# EAGLE design BikeLight POC (EAGLE 8.5.0)
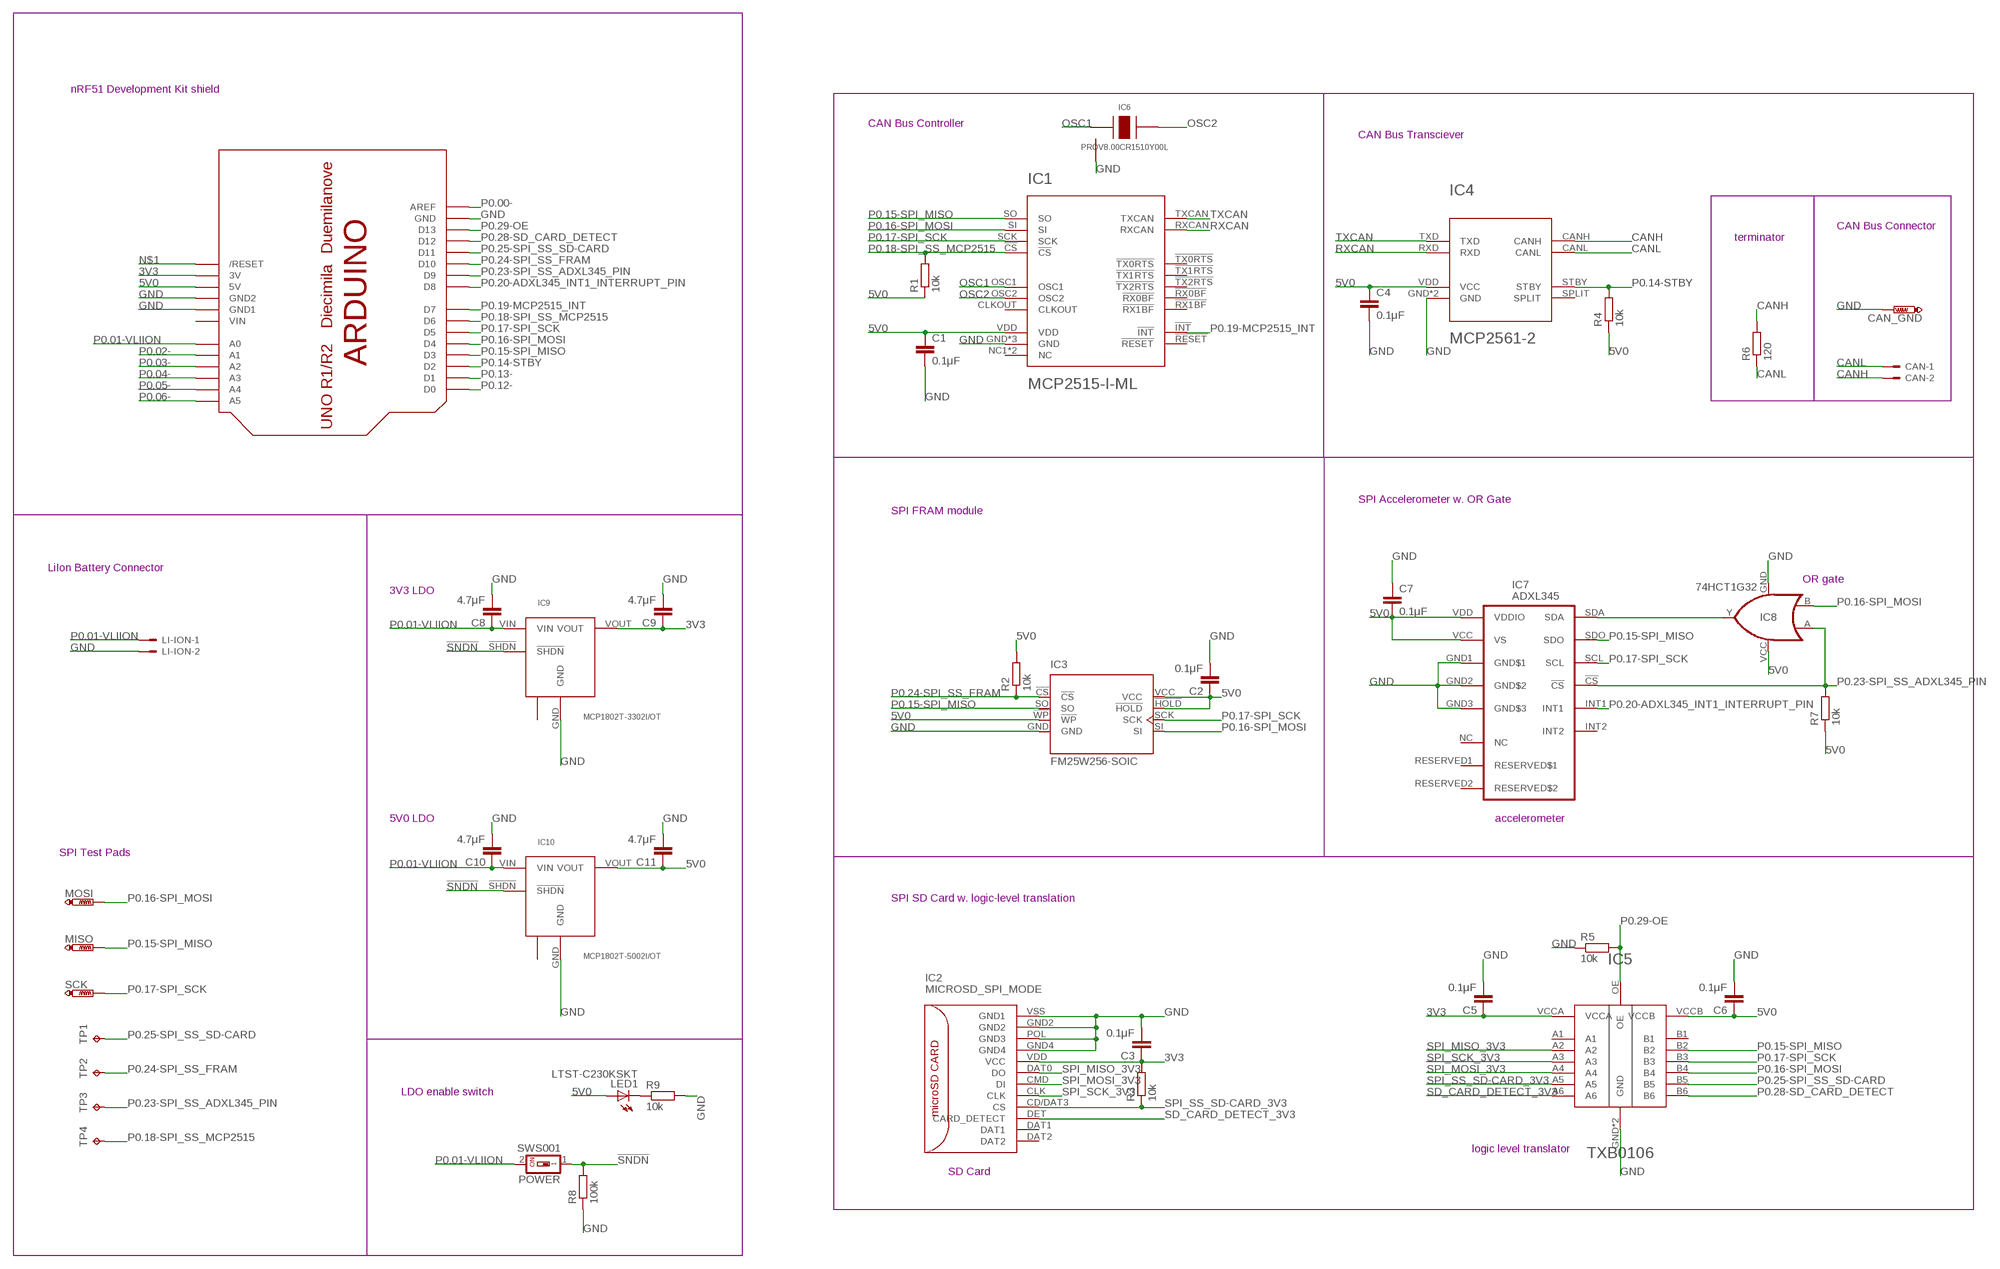
[diagram p0: schematic, sheet 1]

## Parts
BRD1  BikeLight POC  ARDUINOUNO  [ARDUINO]
C1  0.1μF  C-EUC0805  [C0805]
C2  0.1μF  C-EUC0805  [C0805]
C3  0.1μF  C-EUC0805  [C0805]
C4  0.1μF  C-EUC0805  [C0805]
C5  0.1μF  C-EUC0805  [C0805]
C6  0.1μF  C-EUC0805  [C0805]
C7  0.1μF  C-EUC0805  [C0805]
C8  4.7μF  C-EUC0805  [C0805]
C9  4.7μF  C-EUC0805  [C0805]
C10  4.7μF  C-EUC0805  [C0805]
C11  4.7μF  C-EUC0805  [C0805]
CAN  22-23-2021  [22-23-2021]
CAN_GND  PTR1PAD1-13Y  [P1-13Y]
IC1  MCP2515-I-ML  [QFN20]
IC2  MICROSD_SPI_MODE  [MICRO_SD_CONNECTOR]
IC3  FM25W256-SOIC  [SOIC08]
IC4  MCP2561-2  [DFN10]
IC5  TXB0106  [VQFN16]
IC6  PRQV8.00CR1510Y00L  PRQV  [SMT]
IC7  ADXL345  [LGA14]
IC8  74HCT1G32  74HCT1G32GW-DC  [SOT353/5]
IC9  MCP1802T-3302I/OT  MCP1802  [SOT23-5]
IC10  MCP1802T-5002I/OT  MCP1802  [SOT23-5]
LED1  LTST-C230KSKT  LEDCHIPLED_1206  [CHIPLED_1206]
LI-ION  22-23-2021  [22-23-2021]
MISO  PTR1PAD1-13Y  [P1-13Y]
MOSI  PTR1PAD1-13Y  [P1-13Y]
POWER  SWS001  [SMS-001]
R1  10k  R-EU_R0805  [R0805]
R2  10k  R-EU_R0805  [R0805]
R3  10k  R-EU_R0805  [R0805]
R4  10k  R-EU_R0805  [R0805]
R5  10k  R-EU_R0805  [R0805]
R6  120  R-EU_R0805  [R0805]
R7  10k  R-EU_R0805  [R0805]
R8  100k  R-EU_R0805  [R0805]
R9  10k  R-EU_R0805  [R0805]
SCK  PTR1PAD1-13Y  [P1-13Y]
TP1  TPPAD1-13  [P1-13]
TP2  TPPAD1-13  [P1-13]
TP3  TPPAD1-13  [P1-13]
TP4  TPPAD1-13  [P1-13]

## Nets
3V3: BRD1.3V C3.1 C5.1 C9.1 IC2.VDD(VCC) IC5.VCCA IC9.VOUT R3.2
5V0: BRD1.5V C1.1 C2.1 C4.1 C6.1 C7.2 C11.1 IC1.VDD IC3.!HOLD! IC3.!WP! IC3.VCC IC4.VDD(VCC) IC5.VCCB IC7.VCC(VS) IC7.VDD(VDDIO) IC8.VCC IC10.VOUT LED1.A R1.1 R2.2 R4.1 R7.1
!SNDN!: IC9.!SHDN! IC10.!SHDN! POWER.1 R8.2
CANH: CAN.2 IC4.CANH R6.2
CANL: CAN.1 IC4.CANL R6.1
GND: BRD1.GND BRD1.GND1 BRD1.GND2 C1.2 C2.2 C3.2 C4.2 C5.2 C6.2 C7.1 C8.2 C9.2 C10.2 C11.2 CAN_GND.TP IC1.GND IC1.GND1(GND) IC1.GND6(GND) IC2.GND2 IC2.GND4 IC2.POL(GND3) IC2.VSS(GND1) IC3.GND IC4.GND IC4.VSS(GND) IC5.GND IC5.GND1(GND) IC6.GND IC7.GND1(GND$1) IC7.GND2(GND$2) IC7.GND3(GND$3) IC8.GND IC9.GND IC10.GND LI-ION.2 R5.1 R8.1 R9.2
N$1: BRD1.RESET(/RESET)
N$2: LED1.C R9.1
OSC1: IC1.OSC1 IC6.XTAL1
OSC2: IC1.OSC2 IC6.XTAL2
P0.00-: BRD1.AREF
P0.01-VLIION: BRD1.A0 C8.1 C10.1 IC9.VIN IC10.VIN LI-ION.1 POWER.2
P0.02-: BRD1.A1
P0.03-: BRD1.A2
P0.04-: BRD1.A3
P0.05-: BRD1.A4
P0.06-: BRD1.A5
P0.12-: BRD1.D0
P0.13-: BRD1.D1
P0.14-STBY: BRD1.D2 IC4.STBY R4.2
P0.15-SPI_MISO: BRD1.D3 IC1.SO IC3.SO IC5.B2 IC7.SDO MISO.TP
P0.16-SPI_MOSI: BRD1.D4 IC1.SI IC3.SI IC5.B4 IC8.B MOSI.TP
P0.17-SPI_SCK: BRD1.D5 IC1.SCK IC3.SCK IC5.B3 IC7.SCL SCK.TP
P0.18-SPI_SS_MCP2515: BRD1.D6 IC1.!CS! R1.2 TP4.TP
P0.19-MCP2515_INT: BRD1.D7 IC1.!INT!
P0.20-ADXL345_INT1_INTERRUPT_PIN: BRD1.D8 IC7.INT1
P0.23-SPI_SS_ADXL345_PIN: BRD1.D9 IC7.!CS! IC8.A R7.2 TP3.TP
P0.24-SPI_SS_FRAM: BRD1.D10 IC3.!CS! R2.1 TP2.TP
P0.25-SPI_SS_SD-CARD: BRD1.D11 IC5.B5 TP1.TP
P0.28-SD_CARD_DETECT: BRD1.D12 IC5.B6
P0.29-OE: BRD1.D13 IC5.OE R5.2
RXCAN: IC1.RXCAN IC4.RXD
SD_CARD_DETECT_3V3: IC2.DET(CARD_DETECT) IC5.A6
SDA: IC7.SDA IC8.Y
SPI_MISO_3V3: IC2.DAT0(DO) IC5.A2
SPI_MOSI_3V3: IC2.CMD(DI) IC5.A4
SPI_SCK_3V3: IC2.CLK IC5.A3
SPI_SS_SD-CARD_3V3: IC2.CD/DAT3(CS) IC5.A5 R3.1
TXCAN: IC1.TXCAN IC4.TXD
Unconnected: IC1.!RESET! IC1.!RX0BF! IC1.!RX1BF! IC1.!TX0RTS! IC1.!TX1RTS! IC1.!TX2RTS! IC1.CLKOUT IC1.NC1(NC) IC1.NC2(NC) IC2.DAT1 IC2.DAT2 IC4.SPLIT IC5.A1 IC5.B1 IC7.INT2 IC7.NC IC7.RESERVED1(RESERVED$1) IC7.RESERVED2(RESERVED$2) IC9.NC IC10.NC

## Notes on the sheet
- nRF51 Development Kit shield
- CAN Bus Controller
- CAN Bus Transciever
- CAN Bus Connector
- terminator
- SPI Accelerometer w. OR Gate
- SPI FRAM module
- LiIon Battery Connector
- OR gate
- 3V3 LDO
- 5V0 LDO | accelerometer
- SPI Test Pads
- SPI SD Card w. logic-level translation
- LDO enable switch
- logic level translator
- SD Card

## Power pins joined to a net without a drawn wire
VIN: BRD1.VIN

## Library data of the parts
BRD1 = adafruit:ARDUINO: Arduino Diecimila/Duemilanove Make a shield with ease, this package has all the named pins as well as the two mounting drill holes and an outline of the USB and DC power connector. The outline is on the DIMENSION layer, so if your board house uses it they will cut the outline to match. http://www.ladyada.net/library/pcb/eaglelibrary.html
C1-C11 = rcl:C-EU: CAPACITOR, European symbol
CAN LI-ION = con-molex:22-23-2021: .100" (2.54mm) Center Header - 2 Pin; MF: MOLEX; MPN: 22-23-2021; OC_FARNELL: 1462926; OC_NEWARK: 25C3832
CAN_GND MISO MOSI SCK = testpad:PTR1: TEST PIN
IC1 = MCP2515-I-ML - Standalonce CAN Controller with SPI Interface:MCP2515-I-ML
IC2 = Molex SD-47309 SD Card Slot:MICROSD_SPI_MODE: MOLEX - 49225-0821 - CONNECTEUR MICRO SD PUSH/PUSH REV Fabricant: MOLEX Code commande Farnell: 1366700 <http://fr.farnell.com/molex/49225-0821/connecteur-micro-sd-push-push-rev/dp/1366700?Ntt=1366700> Référence fabricant: 49225-0821
IC3 = FM25W256 FERAM:FM25W256: FeRAM Module; OC_FARNELL: unknown; OC_NEWARK: unknown
IC4 = MCP2561-2 - High-Speed CAN Transceiver:MCP2561-2
IC5 = TXB0106 - Logic Level Translator:TXB0106
IC6 = PRQV8.00CR1510Y00L - 8MHz resonator:PRQV
IC7 = ADXL345 Accelerometer:ADXL345: 3-Axis, ±2 g/±4 g/±8 g/±16 g Digital Accelerometer
IC8 = 74HCT1G32GW - OR Gate:74HCT1G32GW: Two Input OR gate
IC9 IC10 = MCP1802 LDO:MCP1802
LED1 = led:LED: LED OSRAM: - CHIPLED LG R971, LG N971, LY N971, LG Q971, LY Q971, LO R971, LY R971 LH N974, LH R974 LS Q976, LO Q976, LY Q976 LO Q996 - Hyper CHIPLED LW Q18S LB Q993, LB Q99A, LB R99A - SideLED LS A670, LO A670, LY A670, LG A670, LP A670 LB A673, LV A673, LT A673, LW A673 LH A674 LY A675 LS A676, LA A676, LO A676, LY A676, LW A676 LS A679, LY A679, LG A679 - Hyper Micro SIDELED® LS Y876, LA Y876, LO Y876, LY Y876 LT Y87S - SmartLED LW L88C, LW L88S LB L89C, LB L89S, LG L890 LS L89K, LO L89K, LY L89K LS L896, LA L896, LO L896, LY L896 - TOPLED LS T670, LO T670, LY T670, LG T670, LP T670 LSG T670, LSP T670, LSY T670, LOP T670, LYG T670 LG T671, LOG T671, LSG T671 LB T673, LV T673, LT T673, LW T673 LH T674 LS T676, LA T676, LO T676, LY T676, LB T676, LH T676, LSB T676, LW T676 LB T67C, LV T67C, LT T67C, LS T67K, LO T67K, LY T67K, LW E67C LS E67B, LA E67B, LO E67B, LY E67B, LB E67C, LV E67C, LT E67C LW T67C LS T679, LY T679, LG T679 LS T770, LO T770, LY T770, LG T770, LP T770 LB T773, LV T773, LT T773, LW T773 LH T774 LS E675, LA E675, LY E675, LS T675 LS T776, LA T776, LO T776, LY T776, LB T776 LHGB T686 LT T68C, LB T68C - Hyper Mini TOPLED® LB M676 - Mini TOPLED Santana® LG M470 LS M47K, LO M47K, LY M47K Source: http://www.osram.convergy.de LUXEON: - LUMILED® LXK2-PW12-R00, LXK2-PW12-S00, LXK2-PW14-U00, LXK2-PW14-V00 LXK2-PM12-R00, LXK2-PM12-S00, LXK2-PM14-U00 LXK2-PE12-Q00, LXK2-PE12-R00, LXK2-PE12-S00, LXK2-PE14-T00, LXK2-PE14-U00 LXK2-PB12-K00, LXK2-PB12-L00, LXK2-PB12-M00, LXK2-PB14-N00, LXK2-PB14-P00, LXK2-PB14-Q00 LXK2-PR12-L00, LXK2-PR12-M00, LXK2-PR14-Q00, LXK2-PR14-R00 LXK2-PD12-Q00, LXK2-PD12-R00, LXK2-PD12-S00 LXK2-PH12-R00, LXK2-PH12-S00 LXK2-PL12-P00, LXK2-PL12-Q00, LXK2-PL12-R00 Source: www.luxeon.com KINGBRIGHT: KA-3528ASYC Source: www.kingbright.com
POWER = smd-special:SWS001: SMD Dip Switch 1 pol.
R1-R9 = rcl:R-EU_: RESISTOR, European symbol
TP1-TP4 = testpad:TP: Test pad

## Board
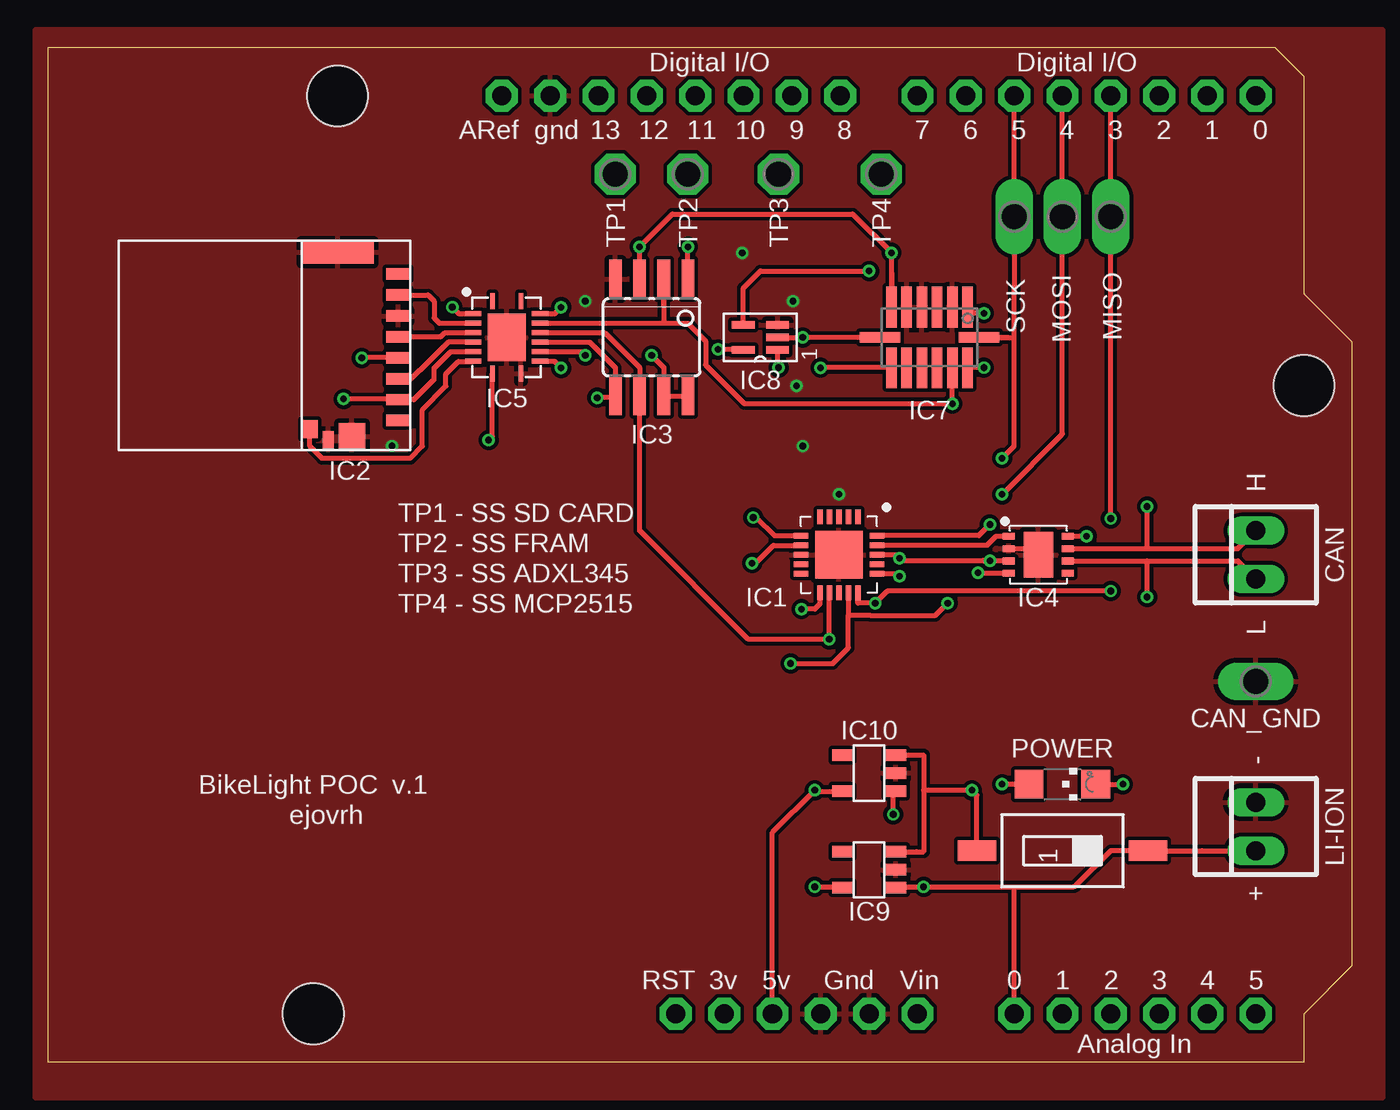
[diagram p1: board, top side]
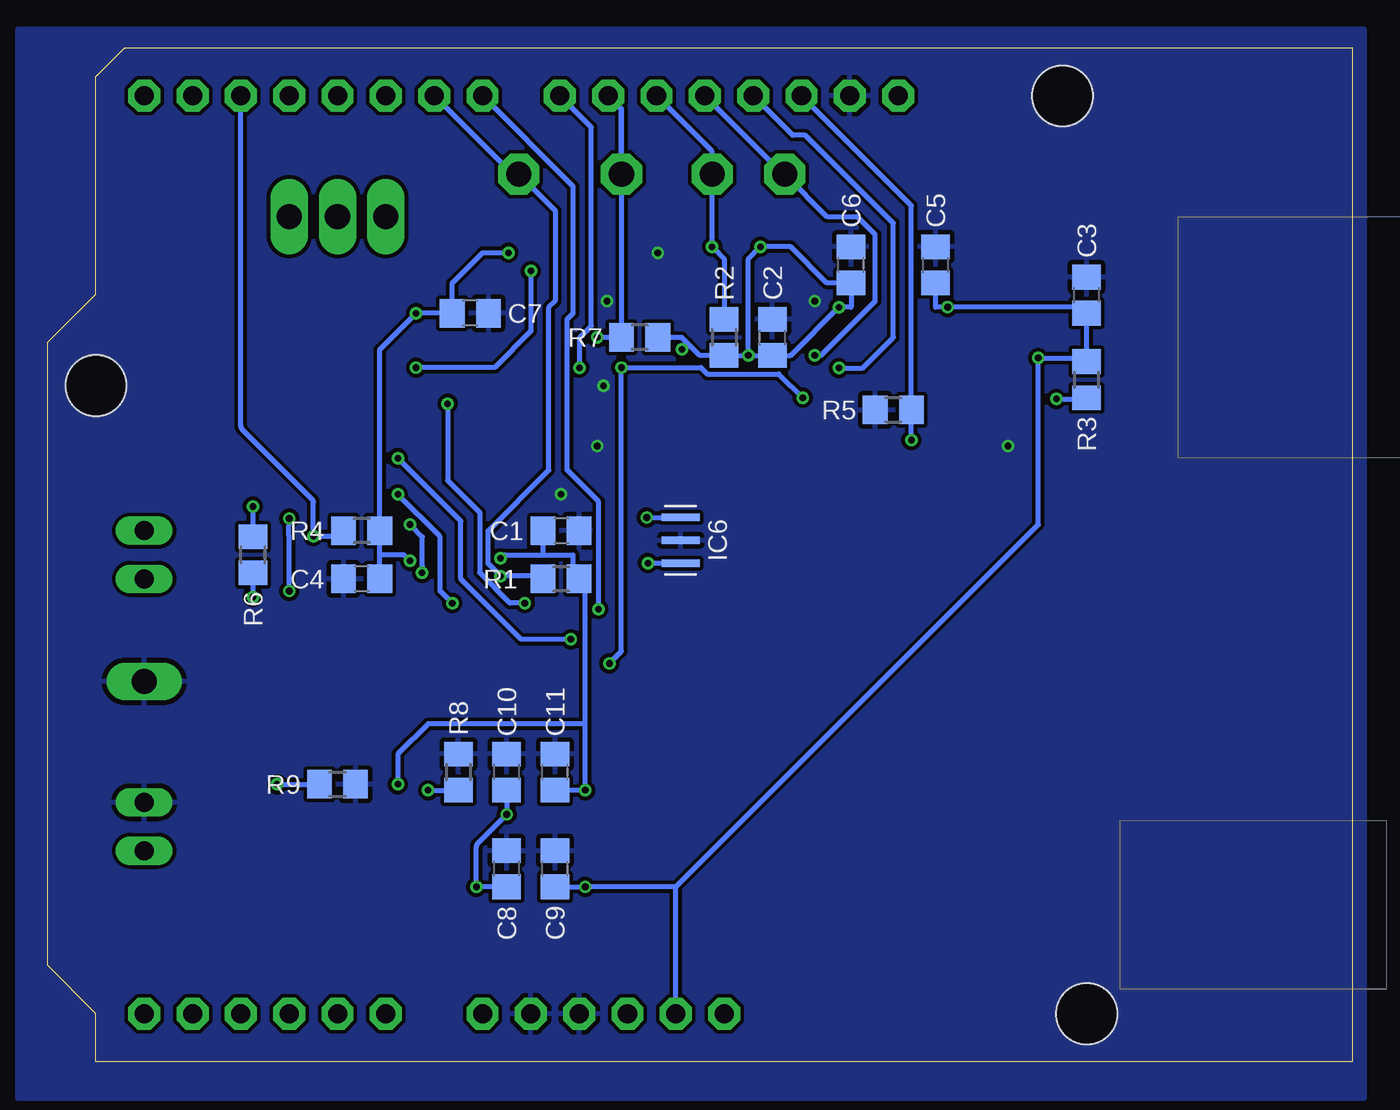
[diagram p2: board, bottom side, seen from below]

Size 68.58 x 53.34 mm. Coordinates in mm from the lower left corner, seen from the top.
Copper layers (1*16): Top 0.035mm / dielectric 1.5mm / Bottom 0.035mm
Design rules "markovac_2layer": minimum track width 0.2mm, minimum drill 0.3mm, track to track 0.2mm, track to pad 0.2mm, pad to pad 0.2mm, via to via 0.2mm, smd to smd 0.2mm, copper to edge 0mil, drill to drill 8mil, minimum pad ring 0.15mm, minimum via ring 0.15mm, stop-mask expansion 4mil, vias tented up to drill 25mil, thermal gap 10mil

### Footprints (pad centres in the part's own frame; a part is rotated, then mirrored left to right if it is on the bottom)
ARDUINO = drill 1 pad 1.676 octagon: 3V 35.56,2.54; 5V 38.1,2.54; A0 50.8,2.54; A1 53.34,2.54; A2 55.88,2.54; A3 58.42,2.54; A4 60.96,2.54; A5 63.5,2.54; AREF 23.876,50.8; D0 63.5,50.8; D1 60.96,50.8; D2 58.42,50.8; D3 55.88,50.8; D4 53.34,50.8; D5 50.8,50.8; D6 48.26,50.8; D7 45.72,50.8; D8 41.656,50.8; D9 39.116,50.8; D10 36.576,50.8; D11 34.036,50.8; D12 31.496,50.8; D13 28.956,50.8; GND 26.416,50.8; GND1 43.18,2.54; GND2 40.64,2.54; RESET 33.02,2.54; VIN 45.72,2.54 | hole 3.2: 15.24,50.8; 66.04,35.56; 13.97,2.54
C0805 = smd 1.3 x 1.5: 1 -0.95,0; 2 0.95,0
22-23-2021 = drill 1 long: 1 -1.27,0; 2 1.27,0
P1-13Y = drill 1.321 pad 1.905 long: TP 0,0
QFN20 = smd 0.3 x 0.75: !CS! 1,2; !RESET! 0.5,2; !RX0BF! 1,-2; !RX1BF! 0.5,-2; GND6 0,-2; OSC1 -0.5,-2; OSC2 -1,-2; RXCAN -1,2; TXCAN -0.5,2; VDD 0,2 | smd 0.75 x 0.3: !INT! 2,-1; !TX0RTS! -2,0.5; !TX1RTS! -2,0; !TX2RTS! -2,-1; CLKOUT -2,1; NC1 -2,-0.5; NC2 2,0; SCK 2,-0.5; SI 2,0.5; SO 2,1 | smd 2.5 x 2.5: GND 0,0; GND1 0,0
MICRO_SD_CONNECTOR = smd 0.6 x 1.25: CD/DAT3 8.35,-0.63; CLK 5.05,-0.63; CMD 7.25,-0.63; DAT0 2.85,-0.63; DAT1 1.75,-0.63; DAT2 9.45,-0.63; VDD 6.15,-0.63; VSS 3.95,-0.63 | smd 0.95 x 0.85: DET 9.9,-5.27 | smd 1.45 x 1.4: GND2 10.3,-3.05 | smd 1.2 x 3.79: GND4 0.6,-3.81 | smd 1 x 0.6: POL 10.5,-4.3
SOIC08 = smd 0.66 x 2.032: !CS! -1.905,-3.073; !HOLD! -0.635,3.073; !WP! 0.635,-3.073; GND 1.905,-3.073; SCK 0.635,3.073; SI 1.905,3.073; SO -0.635,-3.073; VCC -1.905,3.073
DFN10 = smd 0.35 x 0.65: CANH -0.325,1.55; CANL 0.325,1.55; RXD 0.975,-1.55; SPLIT 0.975,1.55; STBY -0.975,1.55; TXD -0.975,-1.55; VDD 0.325,-1.55; VSS -0.325,-1.55 | smd 2.4 x 1.55: GND 0,0
VQFN16 = smd 0.85 x 0.25: A1 -1.9,-0.75; B1 -1.9,0.75; GND1 1.9,0.75; OE 1.9,-0.75 | smd 0.25 x 0.85: A2 -0.75,-1.75; A3 -0.25,-1.75; A4 0.25,-1.75; A5 0.75,-1.75; A6 1.25,-1.75; B2 -0.75,1.75; B3 -0.25,1.75; B4 0.25,1.75; B5 0.75,1.75; B6 1.25,1.75; VCCA -1.25,-1.75; VCCB -1.25,1.75 | smd 2.5 x 2: GND 0,0
SMT = smd 0.4 x 2: GND 0,0; XTAL1 -1.2,0; XTAL2 1.2,0
LGA14 = smd 0.55 x 2.145: !CS! 0,-2.6; SCL 0,2.6 | smd 2.145 x 0.55: GND1 -1.6,-1.2; GND2 -1.6,-0.4; GND3 -1.6,1.2; INT1 1.6,-2; INT2 1.6,-1.2; NC 1.6,-0.4; RESERVED1 1.6,0.4; RESERVED2 -1.6,0.4; SDA 1.6,2; SDO 1.6,1.2; VCC -1.6,-2; VDD -1.6,2
SOT353/5 = smd 0.4 x 1.2: A 0,-0.9; B -0.65,-0.9; GND 0.65,-0.9; VCC -0.65,0.9; Y 0.65,0.9
SOT23-5 = smd 0.6 x 1.1: !SHDN! 0.9,-1.4; GND -0.05,-1.4; NC 0.9,1.4; VIN -1,-1.4; VOUT -1,1.4
CHIPLED_1206 = smd 1.5 x 1.5: A 0,-1.75; C 0,1.75
SMS-001 = smd 1.092 x 2.007: 1 0,-4.496; 2 0,4.496
R0805 = smd 1.3 x 1.5: 1 -0.95,0; 2 0.95,0
P1-13 = drill 1.321 pad 2.159 octagon: TP 0,0

### Placement (x,y rotation side)
BRD1  0,0 0 top
C1  41.59,27.94 0 bottom
C2  30.48,38.1 90 bottom
C3  13.97,40.32 90 bottom
C4  52.07,25.4 180 bottom
C5  21.91,41.91 90 bottom
C6  26.35,41.91 90 bottom
C7  46.35,39.37 180 bottom
C8  44.45,10.16 90 bottom
C9  41.91,10.16 90 bottom
C10  44.45,15.24 90 bottom
C11  41.91,15.24 90 bottom
CAN  63.5,26.67 90 top
CAN_GND  63.5,20 90 top
IC1  41.59,26.67 270 top
IC2  19.05,43.18 270 top
IC3  31.75,38.1 180 top
IC4  52.07,26.67 270 top
IC5  24.13,38.1 270 top
IC6  35.31,27.43 90 bottom
IC7  46.35,38.1 270 top
IC8  37.47,38.1 90 top
IC9  43.18,10.16 90 top
IC10  43.18,15.24 90 top
LED1  53.34,14.61 270 top
LI-ION  63.5,12.38 90 top
MISO  55.88,44.45 0 top
MOSI  53.34,44.45 0 top
POWER  53.34,11.11 270 top
R1  41.59,25.4 180 bottom
R2  33.02,38.1 270 bottom
R3  13.97,35.88 90 bottom
R4  52.07,27.94 180 bottom
R5  24.13,34.29 0 bottom
R6  57.78,26.67 90 bottom
R7  37.47,38.1 180 bottom
R8  46.99,15.24 270 bottom
R9  53.34,14.61 0 bottom
SCK  50.8,44.45 0 top
TP1  29.84,46.67 0 top
TP2  33.66,46.67 0 top
TP3  38.42,46.67 0 top
TP4  43.81,46.67 0 top

### Tracks (layer width: path | path; a pad name or v marks a point on that pad's centre or on a via)
3V3  (via drill 0.35)
  Top 0.254: v21.27,39.69 21.61,39.35 IC5.VCCA | v40.32,9.21 41.73,9.21 IC9.VOUT | IC2.VDD v16.52,37.03 v16.51,37.02
  Bottom 0.254: C9.1 v40.32,9.21 35.56,9.21 | BRD1.3V 35.56,9.21 | 35.56,9.21 16.51,28.26 v16.51,37.02 14.16,37.02 R3.2 C3.1 14.29,39.69 v21.27,39.69 21.91,39.69 C5.1
5V0  (via drill 0.35)
  Top 0.254: IC5.VCCB 26.65,39.35 v26.99,39.69 | IC4.VDD v49.53,26.35 49.18,26.35 49.16,26.37 44.88,26.37 v44.77,26.48 44.58,26.67 IC1.VDD | IC10.VOUT 40.37,14.24 v40.32,14.29 38.1,12.06 BRD1.5V | IC3.!WP! v31.11,42.86 32.84,44.59 42.31,44.59 v44.35,42.55 IC7.VCC 44.35,41.5 | v49.21,39.37 48.69,39.37 IC7.VDD | IC3.VCC IC3.!HOLD! 32.38,36.52 v31.75,37.15 | IC8.VCC 35.26,37.45 v35.24,37.47 | LED1.A v50.16,14.61
  Bottom 0.254: v31.75,37.15 R2.2 34.29,37.15 34.92,37.78 | v31.75,37.15 C2.1 29.52,37.15 v26.99,39.69 26.35,39.69 C6.1 27.62,40.96 29.53,42.86 v31.11,42.86 31.75,42.23 v31.75,37.15 | C4.1 51.12,26.67 | 51.12,26.67 R4.1 51.12,37.46 v49.21,39.37 C7.2 47.3,40.96 45.72,42.55 v44.35,42.55 | 42.55,26.67 40.96,26.67 40.96,25.71 R1.1 40.32,25.08 40.32,17.78 | 42.23,27.62 C1.1 42.54,26.67 42.55,26.67 | v49.53,26.35 49.85,26.67 51.12,26.67 | C11.1 v40.33,14.29 v40.32,14.29 40.32,17.78 | 34.92,37.78 35.24,38.1 R7.1 | v44.77,26.48 44.58,26.67 42.55,26.67 | v35.24,37.47 34.92,37.78 | 40.32,17.78 48.58,17.78 50.16,16.19 v50.16,14.61
!SNDN!  (via drill 0.35)
  Top 0.254: 45.67,11.06 IC9.!SHDN! 46.04,11.06 46.04,14.29 | IC10.!SHDN! 46.04,16.14 46.04,14.29 | 48.79,11.06 POWER.1 48.84,14.02 v48.58,14.29 46.04,14.29
  Bottom 0.254: v48.58,14.29 R8.2
CANH  (via drill 0.35)
  Top 0.254: IC4.CANH 57.78,27 | 57.78,27 62.55,27 CAN.2 | 57.78,27 v57.78,29.21
  Bottom 0.254: v57.78,29.21 R6.2
CANL  (via drill 0.35)
  Top 0.254: IC4.CANL 57.78,26.34 | 57.78,26.34 62.55,26.34 CAN.1 | v57.78,24.45 57.78,26.34
  Bottom 0.254: R6.1 v57.78,24.45
GND  (via drill 0.35)
  Top 0.254: IC4.VSS 51.74,27 IC4.GND
  other vias: 18.1,32.38 36.51,42.55 28.26,40.01 39.37,35.56 39.69,32.38 41.59,29.84 39.18,40.01
  pour Top: -0.64,54.29 70.17,54.29 70.17,-1.91 -0.64,-1.91
  pour Bottom: -0.64,54.29 70.17,54.29 70.17,-1.91 -0.64,-1.91
N$2  (via drill 0.35)
  Top 0.254: LED1.C v56.52,14.61
  Bottom 0.254: v56.52,14.61 R9.1
OSC1  (via drill 0.35)
  Top 0.254: IC1.OSC1 38.15,27.17 37.22,26.23 v37.03,26.23
  Bottom 0.254: v37.03,26.23 IC6.XTAL1
OSC2  (via drill 0.35)
  Top 0.254: IC1.OSC2 38.22,27.67 37.26,28.63 v37.09,28.63
  Bottom 0.254: v37.09,28.63 IC6.XTAL2
P0.01-VLIION  (via drill 0.35)
  Top 0.254: v44.45,13.02 44.45,14.11 IC10.VIN | 44.45,9.03 IC9.VIN arc-45 44.7,9.21 v46.04,9.21 50.8,9.21 | BRD1.A0 50.8,9.21 | POWER.2 55.88,11.11 54.05,9.28 arc-45 53.87,9.21 50.8,9.21 | POWER.2 60.68,11.11 | POWER.2 LI-ION.1
  Bottom 0.254: C10.1 v44.45,13.02 45.96,11.5 arc-45 46.04,11.32 v46.04,9.21 C8.1
P0.14-STBY  (via drill 0.35)
  Top 0.254: IC4.STBY v54.6,27.64 arc45 v54.61,27.65
  Bottom 0.254: R4.2 53.24,27.72 arc45 53.42,27.65 v54.61,27.65 54.61,29.42 arc-45 54.68,29.6 58.35,33.26 arc45 58.42,33.44 BRD1.D2
P0.15-SPI_MISO  (via drill 0.35)
  Top 0.254: IC5.B2 32.38,38.85 | 32.38,39.69 IC3.SO 32.38,38.85 | IC1.SO 42.59,24.13 v43.5,24.13 44.08,24.71 arc-45 44.26,24.78 55.84,24.78 arc-45 v55.88,24.77 | IC7.SDO v47.55,34.61 36.63,34.61 34.59,36.65 34.59,37.91 33.66,38.85 32.38,38.85 | v55.88,28.57 BRD1.D3 MISO.TP
  Bottom 0.254: v43.5,24.13 44.28,24.13 45.87,25.73 45.87,28.89 47.55,30.57 v47.55,34.61 | v55.88,24.77 55.88,27.65 55.9,27.67 55.9,28.21 55.88,28.23 v55.88,28.57
P0.16-SPI_MOSI  (via drill 0.35)
  Top 0.254: IC5.B4 28.51,37.85 29.84,36.51 IC3.SI 29.74,34.92 v28.89,34.92 | v38.42,36.51 38.37,36.56 IC8.B | IC1.SI 42.09,23.5 | 42.09,23.5 43.21,23.5 43.23,23.48 46.66,23.48 v47.31,24.13 | v39.05,20.95 41.27,20.95 42.09,21.77 42.09,23.5 | v50.16,29.84 53.34,33.02 BRD1.D4 MOSI.TP
  Bottom 0.254: v50.16,29.84 47.94,27.62 47.94,24.77 v47.31,24.13 | v28.89,34.92 30.14,36.17 33.91,36.17 34.24,36.51 v38.42,36.51 38.42,21.59 v39.05,20.95
P0.17-SPI_SCK  (via drill 0.35)
  Top 0.254: IC5.B3 29.28,38.35 31.11,36.51 IC3.SCK 31.11,27.94 36.83,22.23 v41.08,22.23 41.09,22.23 IC1.SCK | 50.48,38.1 IC7.SCL 50.8,38.1 | 50.8,38.1 50.8,40.64 SCK.TP BRD1.D5 | v50.16,31.75 50.8,32.38 50.8,38.1
  Bottom 0.254: v41.08,22.23 43.68,22.23 46.85,25.4 46.85,28.44 v50.16,31.75
P0.18-SPI_SS_MCP2515  (via drill 0.35)
  Top 0.254: v44.77,25.54 44.64,25.67 IC1.!CS!
  Bottom 0.254: R1.2 42.68,25.54 v44.77,25.54 44.77,25.56 45.42,26.21 45.42,27.92 42.23,31.11 42.23,39.69 41.91,40.01 41.91,44.77 TP4.TP 44.13,46.67 BRD1.D6
P0.19-MCP2515_INT  (via drill 0.35)
  Top 0.254: IC1.!INT! 40.59,24.08 40.32,23.81 v39.62,23.81
  Bottom 0.254: BRD1.D7 40.96,46.04 40.96,39.37 41.27,39.05 41.27,31.11 39.62,29.46 v39.62,23.81
P0.20-ADXL345_INT1_INTERRUPT_PIN  (via drill 0.35)
  Top 0.254: IC7.INT1 v40.62,36.5
  Bottom 0.254: BRD1.D8 40.01,49.15 40.01,38.7 40.62,38.09 v40.62,36.5
P0.23-SPI_SS_ADXL345_PIN  (via drill 0.35)
  Top 0.254: IC7.!CS! v39.69,38.1 IC8.A
  Bottom 0.254: R7.2 v39.69,38.1 | R7.2 38.41,50.1 BRD1.D9 38.42,50.1 TP3.TP | R7.2
P0.24-SPI_SS_FRAM  (via drill 0.35)
  Top 0.254: IC3.!CS! v33.66,42.86
  Bottom 0.254: R2.1 33.02,42.23 v33.66,42.86 TP2.TP 33.66,47.88 BRD1.D10
P0.25-SPI_SS_SD-CARD  (via drill 0.35)
  Top 0.254: IC5.B5 28.05,37.35 v28.26,37.15
  Bottom 0.254: v28.26,37.15 27.94,37.15 25.08,40.01 25.08,43.5 26.04,44.45 27.62,44.45 TP1.TP | BRD1.D11 29.91,46.67 TP1.TP | TP1.TP
P0.28-SD_CARD_DETECT  (via drill 0.35)
  Top 0.254: IC5.B6 26.63,36.85 v26.99,36.49
  Bottom 0.254: BRD1.D12 29.42,48.72 28.75,48.72 24.16,44.13 24.13,44.13 24.13,38.09 25.73,36.49 v26.99,36.49
P0.29-OE  (via drill 0.35)
  Top 0.254: v23.18,32.7 23.38,32.91 IC5.OE
  Bottom 0.254: BRD1.D13 23.18,45.02 R5.2 v23.18,32.7
RXCAN  (via drill 0.35)
  Top 0.254: v49.53,28.26 48.94,27.67 IC1.RXCAN | IC4.RXD 48.92,25.7 v48.9,25.72
  Bottom 0.254: v48.9,25.72 48.9,26.07 48.88,26.08 48.88,27.61 v49.53,28.26
SD_CARD_DETECT_3V3
  Top 0.254: IC2.DET 13.78,32.38 14.43,31.73 19.05,31.73 19.69,32.38 19.69,34.29 20.94,35.54 20.94,36.18 21.59,36.83 22.36,36.83 IC5.A6
SDA  (via drill 0.35)
  Top 0.254: v49.21,36.51 48.37,36.51 IC7.SDA | v43.18,41.59 37.47,41.59 36.56,40.69 IC8.Y
  Bottom 0.254: v49.21,36.51 45.09,36.51 43.18,38.42 v43.18,41.59
SPI_MISO_3V3
  Top 0.254: IC5.A2 20.59,38.85 20.32,39.12 20.32,40.01 20,40.33 IC2.DAT0
SPI_MOSI_3V3
  Top 0.254: IC2.CMD 19.1,35.93 19.53,36.35 19.55,36.35 21.05,37.85 IC5.A4
SPI_SCK_3V3
  Top 0.254: IC5.A3 20.88,38.35 20.66,38.13 IC2.CLK
SPI_SS_SD-CARD_3V3  (via drill 0.35)
  Top 0.254: 18.58,34.83 IC2.CD/DAT3 | IC5.A5 21.19,37.35 20.3,36.47 20.3,35.88 19.26,34.83 IC2.CD/DAT3 | IC2.CD/DAT3 18.39,34.86 v15.56,34.86
  Bottom 0.254: v15.56,34.86 14.04,34.86 R3.1
TXCAN
  Top 0.254: IC4.TXD 49.85,27.64 49.37,27.17 49.21,27.17 IC1.TXCAN

### Text on the board
tNames: H | TP1 - SS SD CARD | TP2 - SS FRAM | TP3 - SS ADXL345 | TP4 - SS MCP2515 | L | - | BikeLight POC | v.1 | ejovrh | +